# Altium schematic sheet AMU-S04-V00-Microcontroller.SchDoc: AMU Microcontroller
size A3; DrawnBy: Thomas Benedetti; DocumentNumber: 4; Revision: 01; SheetNumber: 4; SheetTotal: 12; Version: 01; Project: AMU 2020; PageSetup: Record=PageOptions|CenterHorizontal=True|CenterVertical=True|PrintScale=0.97|XCorrection=1.00|YCorrection=1.00|PrintKind=0|BorderSize=5000000|LeftOffset=0|BottomOffset=0|Orientation=2|PaperLength=1000|PaperWidth=1000|Scale=100|PaperSource=7|PrintQuality=-4|MediaType=1|DitherType=10|PaperKind=A4|PrintScaleMode=1
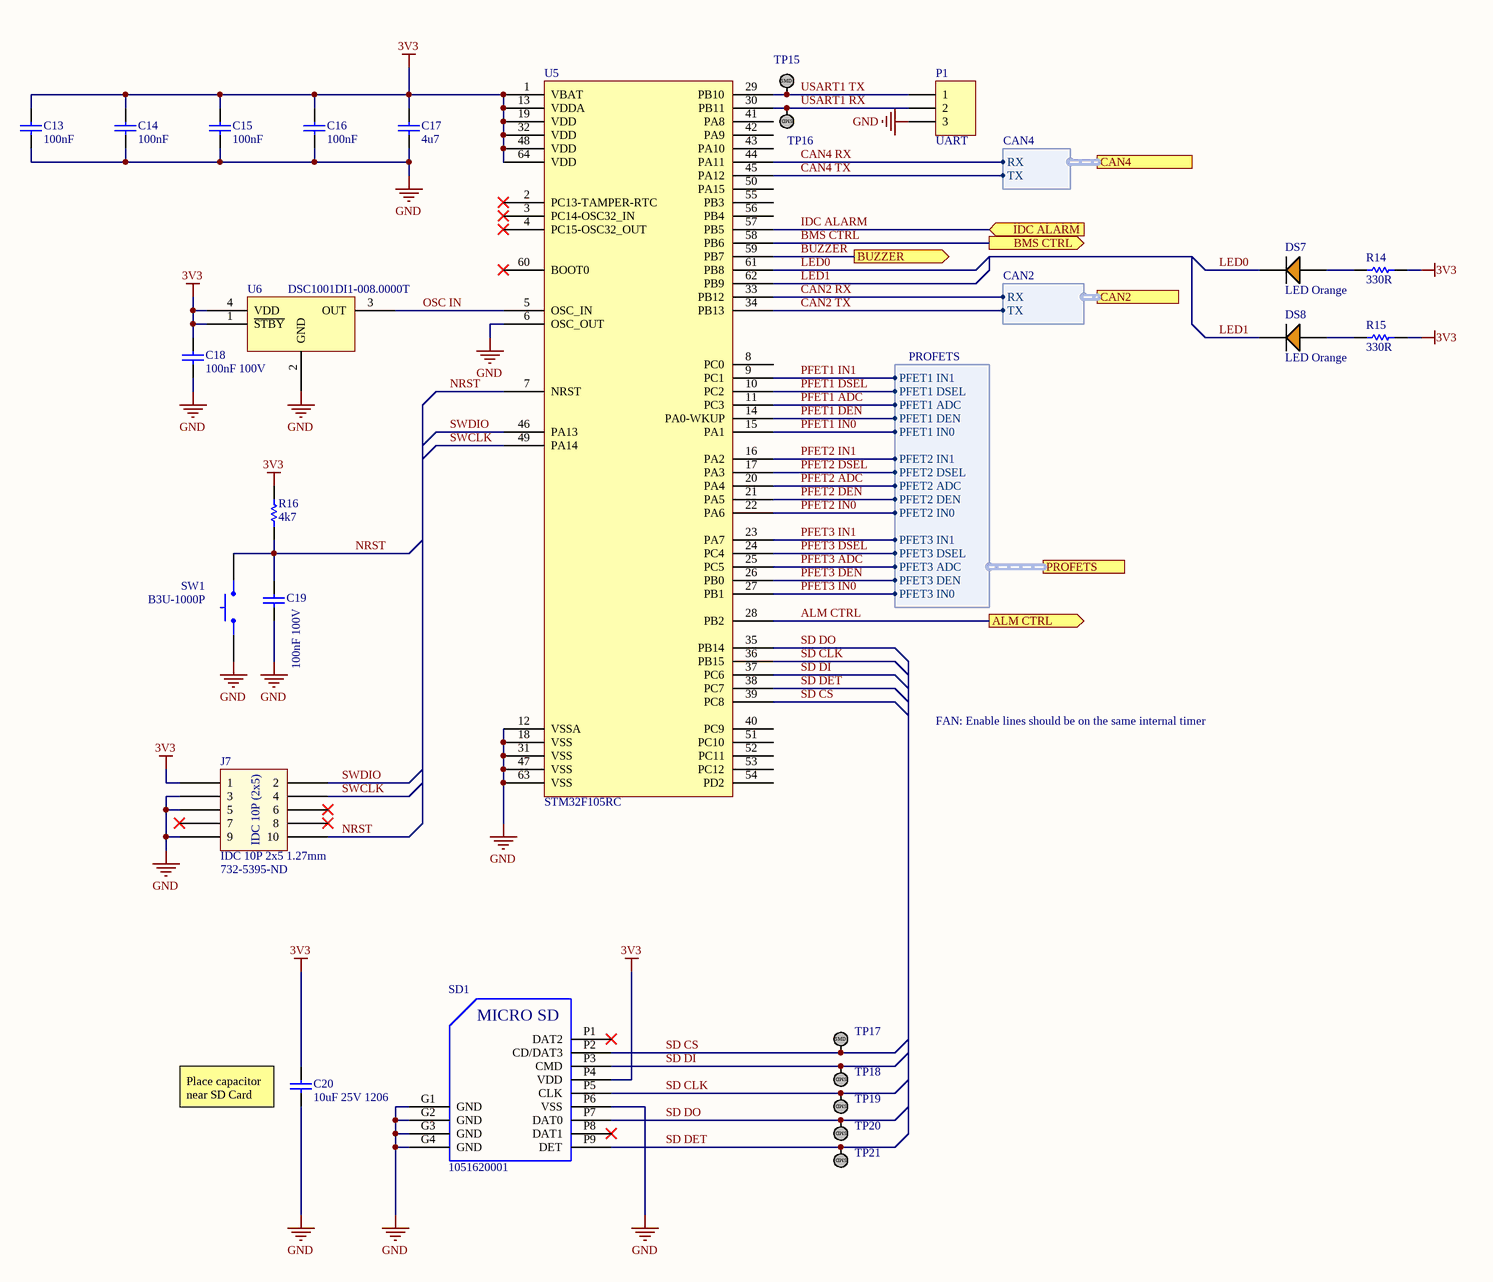
[diagram p0: AMU-S04-V00-Microcontroller.SchDoc]

## Parts
C13  100nF  [Cap_Ceramic_0603]
C14  100nF  [Cap_Ceramic_0603]
C15  100nF  [Cap_Ceramic_0603]
C16  100nF  [Cap_Ceramic_0603]
C17  4u7  [Cap_Ceramic_0603]
C18  100nF 100V  [Cap_Ceramic_0603]
C19  100nF 100V  [Cap_Ceramic_0603]
C20  10uF 25V 1206  [Cap_Ceramic_1206]
DS7  LED Orange  [LED ORANGE 0603]
DS8  LED Orange  [LED ORANGE 0603]
J7  IDC 10P 2x5 1.27mm  [IDC 1.27MM 10P]
P1  UART  [HDR1X3]
R14  330R  [Res_ThinFilm_0603]
R15  330R  [Res_ThinFilm_0603]
R16  4k7  [Res_ThinFilm_0603]
SD1  1051620001  [1051620001]
SW1  B3U-1000P  [BTN B3U-1000P]
TP15  TestPoint_SMD  [TestPointSMD]  (value not drawn)
TP16  TestPoint_SMD  [TestPointSMD]  (value not drawn)
TP17  TestPoint_SMD  [TestPointSMD]  (value not drawn)
TP18  TestPoint_SMD  [TestPointSMD]  (value not drawn)
TP19  TestPoint_SMD  [TestPointSMD]  (value not drawn)
TP20  TestPoint_SMD  [TestPointSMD]  (value not drawn)
TP21  TestPoint_SMD  [TestPointSMD]  (value not drawn)
U5  STM32F105RC  [STM32F105RC]
U6  DSC1001DI1-008.0000T  [DSC1001DI1-008.0000TCT-ND]

## Ports
ALM CTRL (out), BMS CTRL (out), BUZZER (out), CAN2 (harness CAN2), CAN4 (harness CAN4), IDC ALARM (in), PROFETS (harness PROFETS)

## Harnesses
PROFETS: PFET3 IN0, PFET3 DEN, PFET3 ADC, PFET3 DSEL, PFET3 IN1, PFET2 DEN, PFET2 DSEL, PFET2 ADC, PFET2 IN0, PFET2 IN1, PFET1 IN1, PFET1 DEN, PFET1 IN0, PFET1 ADC, PFET1 DSEL
CAN2: TX, RX
CAN4: RX, TX

## Nets
3V3: C13.2 C14.2 C15.2 C16.2 C17.2 C18.2 C20.2 J7.1 R14.2 R15.2 R16.2 SD1.P4(VDD) U5.1(VBAT) U5.13(VDDA) U5.19(VDD) U5.32(VDD) U5.48(VDD) U5.64(VDD) U6.1(~{STBY}) U6.4(VDD)
GND: C13.1 C14.1 C15.1 C16.1 C17.1 C18.1 C19.1 C20.1 J7.3 J7.5 J7.9 P1.3 SD1.G1(GND) SD1.G2(GND) SD1.G3(GND) SD1.G4(GND) SD1.P6(VSS) SW1.1 U5.6(OSC_OUT) U5.12(VSSA) U5.18(VSS) U5.31(VSS) U5.47(VSS) U5.63(VSS) U6.2(GND)
ALM CTRL: U5.28(PB2) ; port ALM CTRL
BMS CTRL: U5.58(PB6) ; port BMS CTRL
BUZZER: U5.59(PB7) ; port BUZZER
CAN2 RX: U5.33(PB12) ; port CAN2.RX
CAN2 TX: U5.34(PB13) ; port CAN2.TX
CAN4 RX: U5.44(PA11) ; port CAN4.RX
CAN4 TX: U5.45(PA12) ; port CAN4.TX
IDC ALARM: U5.57(PB5) ; port IDC ALARM
LED0: DS7.2(C) U5.61(PB8)
LED1: DS8.2(C) U5.62(PB9)
NRST: C19.2 J7.10 R16.1 SW1.2 U5.7(NRST)
OSC IN: U5.5(OSC_IN) U6.3(OUT)
PFET1 ADC: U5.11(PC3) ; port PROFETS.PFET1 ADC
PFET1 DEN: U5.14(PA0-WKUP) ; port PROFETS.PFET1 DEN
PFET1 DSEL: U5.10(PC2) ; port PROFETS.PFET1 DSEL
PFET1 IN0: U5.15(PA1) ; port PROFETS.PFET1 IN0
PFET1 IN1: U5.9(PC1) ; port PROFETS.PFET1 IN1
PFET2 ADC: U5.20(PA4) ; port PROFETS.PFET2 ADC
PFET2 DEN: U5.21(PA5) ; port PROFETS.PFET2 DEN
PFET2 DSEL: U5.17(PA3) ; port PROFETS.PFET2 DSEL
PFET2 IN0: U5.22(PA6) ; port PROFETS.PFET2 IN0
PFET2 IN1: U5.16(PA2) ; port PROFETS.PFET2 IN1
PFET3 ADC: U5.25(PC5) ; port PROFETS.PFET3 ADC
PFET3 DEN: U5.26(PB0) ; port PROFETS.PFET3 DEN
PFET3 DSEL: U5.24(PC4) ; port PROFETS.PFET3 DSEL
PFET3 IN0: U5.27(PB1) ; port PROFETS.PFET3 IN0
PFET3 IN1: U5.23(PA7) ; port PROFETS.PFET3 IN1
SD CLK: SD1.P5(CLK) TP19.1 U5.36(PB15)
SD CS: SD1.P2(CD/DAT3) TP17.1 U5.39(PC8)
SD DET: SD1.P9(DET) TP21.1 U5.38(PC7)
SD DI: SD1.P3(CMD) TP18.1 U5.37(PC6)
SD DO: SD1.P7(DAT0) TP20.1 U5.35(PB14)
SWCLK: J7.4 U5.49(PA14)
SWDIO: J7.2 U5.46(PA13)
USART1 RX: P1.2 TP16.1 U5.30(PB11)
USART1 TX: P1.1 TP15.1 U5.29(PB10)
NetDS7_1: DS7.1(A) R14.1
NetDS8_1: DS8.1(A) R15.1

Not connected (* = marked no-connect by the designer): J7 6* 7* 8*; SD1 P1(DAT2)* P8(DAT1)*; U5 2(PC13-TAMPER-RTC)* 3(PC14-OSC32_IN)* 4(PC15-OSC32_OUT)* 8(PC0) 40(PC9) 41(PA8) 42(PA9) 43(PA10) 50(PA15) 51(PC10) 52(PC11) 53(PC12) 54(PD2) 55(PB3) 56(PB4) 60(BOOT0)*

## Notes on the sheet
- FAN: Enable lines should be on the same internal timer
- (near J7) 732-5395-ND
- (near C20) Place capacitor near SD Card
- Revision History:
- Sheet Title:
- Rev
- Date
- Description
- Project:
- Size:
- Drawn By:
- A3
- Number:
- Revision:
- Sheet
- Version:
- of
- QUT Motorsport
- O-120, Gardens Point
- 2 George Street
- Brisbane, QLD 4000
- Australia
- Print Date:
- Print Time:
- File Name:
- (in symbol 1051620001) MICRO SD
- (in symbol IDC 10P 2x5 1.27mm) IDC 10P (2x5)
- (in symbol TestPoint_SMD) SMD

## Library data of the parts
C13-C16 = 100nF 50V 5% X7R 0603: Capacitor, Ceramic, SMD, 100nF, 50V, 5%, X7R, 0603
C17 = 4u7 50V 5% X7R 0603: Capacitor, Ceramic, SMD, 4u7, 50V, 5%, X7R, 0603
C18 C19 = 100nF 100V 5% X7R 0603: Capacitor, Ceramic, SMD, 100nF, 100V, 5%, X7R, 0603
C20 = 10uF 25V 10% X7R 1206: Capacitor, Ceramic, SMD, 10uF, 25V, 10%, X7R, 1206
DS7 DS8 = LED ORANGE 0603
P1 = Header 3: Header, 3-Pin; LatestRevisionDate: 17-Jul-2002; LatestRevisionNote: Re-released for DXP Platform.; Publisher: Altium Limited
R14 R15 = 330R 5% 0603: Resistor, SMD, 330R, 0.1W, 5%, 0603
R16 = 4k7 5% 0603: Resistor, SMD, 4k7, 0.1W, 5%, 0603
SD1 = 1051620001: 9 (8 + 1) Position Card Connector microSD™ Surface Mount, Right Angle Gold; ComponentLink1Description: Digikey; ComponentLink1URL: https://www.digikey.com.au/product-detail/en/molex/1051620001/WM14405CT-ND/6133135; ComponentLink2Description: Datasheet; ComponentLink2URL: https://www.molex.com/pdm_docs/sd/1051620001_sd.pdf
SW1 = BTN B3U-1000P: Omron B3U-1000P Ultra Miniture Switch; ComponentLink1Description: LCSC; ComponentLink1URL: https://lcsc.com/product-detail/Tactile-Switches_BRIGHT-TSA063G50-250_C294565.html
U5 = STM32F105RC: ARM® Cortex®-M3 STM32F1 Microcontroller IC 32-Bit 72MHz 256KB (256K x 8) FLASH 64-LQFP (10x10); ComponentLink1Description: Digikey; ComponentLink1URL: https://www.digikey.com.au/product-detail/en/stmicroelectronics/STM32F105RCT6TR/497-17397-1-ND/8024118; ComponentLink2Description: Datasheet; ComponentLink2URL: https://www.st.com/content/ccc/resource/technical/document/datasheet/e4/f3/1a/89/5a/02/46/ae/CD00220364.pdf/files/CD00220364.pdf/jcr:content/translations/en.CD00220364.pdf
U6 = DSC1001DI1-008.0000T: on 8MHz XO (Standard) CMOS Oscillator 1.8 ~ 3.3V Standby (Power Down) 4-SMD, No Lead